# Altium schematic sheet RAK3162_Pinout.SchDoc
size A4; SheetNumber: 3; SheetTotal: 3; PCBA_CODE: 8262XXXX
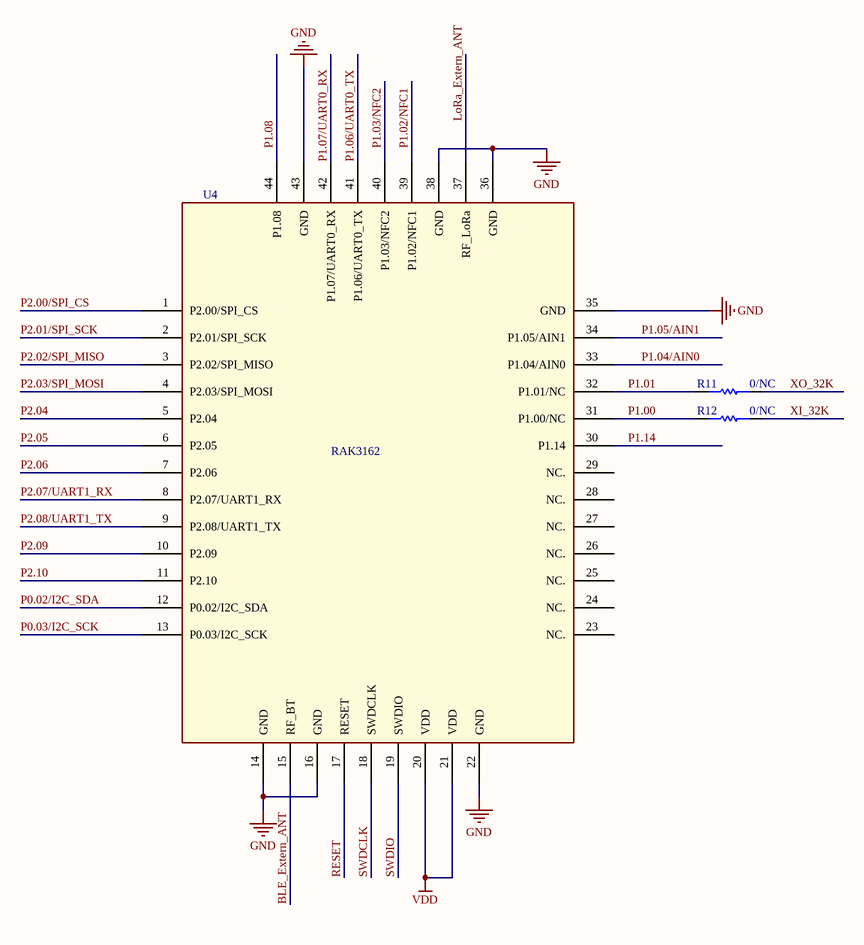
[diagram p0: RAK3162_Pinout.SchDoc]

## Parts
R11  value 0/NC  [sr0201]  (hidden comment: RESISTOR)
R12  value 0/NC  [sr0201]  (hidden comment: RESISTOR)
U4  RAK3162  [RAK4630_PINOUT]

## Nets
GND: U4.14(GND) U4.16(GND) U4.22(GND) U4.35(GND) U4.36(GND) U4.38(GND) U4.43(GND)
VDD: U4.20(VDD) U4.21(VDD)
BLE_Extern_ANT: U4.15(RF_BT)
LoRa_Extern_ANT: U4.37(RF_LoRa)
P0.02/I2C_SDA: U4.12(P0.02/I2C_SDA)
P0.03/I2C_SCK: U4.13(P0.03/I2C_SCK)
P1.00: R12.2 U4.31(P1.00/NC)
P1.01: R11.2 U4.32(P1.01/NC)
P1.02/NFC1: U4.39(P1.02/NFC1)
P1.03/NFC2: U4.40(P1.03/NFC2)
P1.04/AIN0: U4.33(P1.04/AIN0)
P1.05/AIN1: U4.34(P1.05/AIN1)
P1.06/UART0_TX: U4.41(P1.06/UART0_TX)
P1.07/UART0_RX: U4.42(P1.07/UART0_RX)
P1.08: U4.44(P1.08)
P1.14: U4.30(P1.14)
P2.00/SPI_CS: U4.1(P2.00/SPI_CS)
P2.01/SPI_SCK: U4.2(P2.01/SPI_SCK)
P2.02/SPI_MISO: U4.3(P2.02/SPI_MISO)
P2.03/SPI_MOSI: U4.4(P2.03/SPI_MOSI)
P2.04: U4.5(P2.04)
P2.05: U4.6(P2.05)
P2.06: U4.7(P2.06)
P2.07/UART1_RX: U4.8(P2.07/UART1_RX)
P2.08/UART1_TX: U4.9(P2.08/UART1_TX)
P2.09: U4.10(P2.09)
P2.10: U4.11(P2.10)
RESET: U4.17(RESET)
SWDCLK: U4.18(SWDCLK)
SWDIO: U4.19(SWDIO)
XI_32K: R12.1
XO_32K: R11.1

Not connected (* = marked no-connect by the designer): U4 23(NC.) 24(NC.) 25(NC.) 26(NC.) 27(NC.) 28(NC.) 29(NC.)

## Notes on the sheet
- Title
- Size:
- Engineer:
- A4
- Revision:
- Date:
- Sheet
- of

## Library data of the parts
R11 R12 = 0709B00M: Resistor-0Ω-0.5A-50mΩMAX-0201; MANUFACTURER: YAGEO; Part Number: RC0201JR-070RL; RAK Code: K3RS00000JA201; Classification: Thick Film Resistor; CODE: 0709B00M; Tolerance: 50mΩMAX